# Altium project DAC5682.PrjPcb
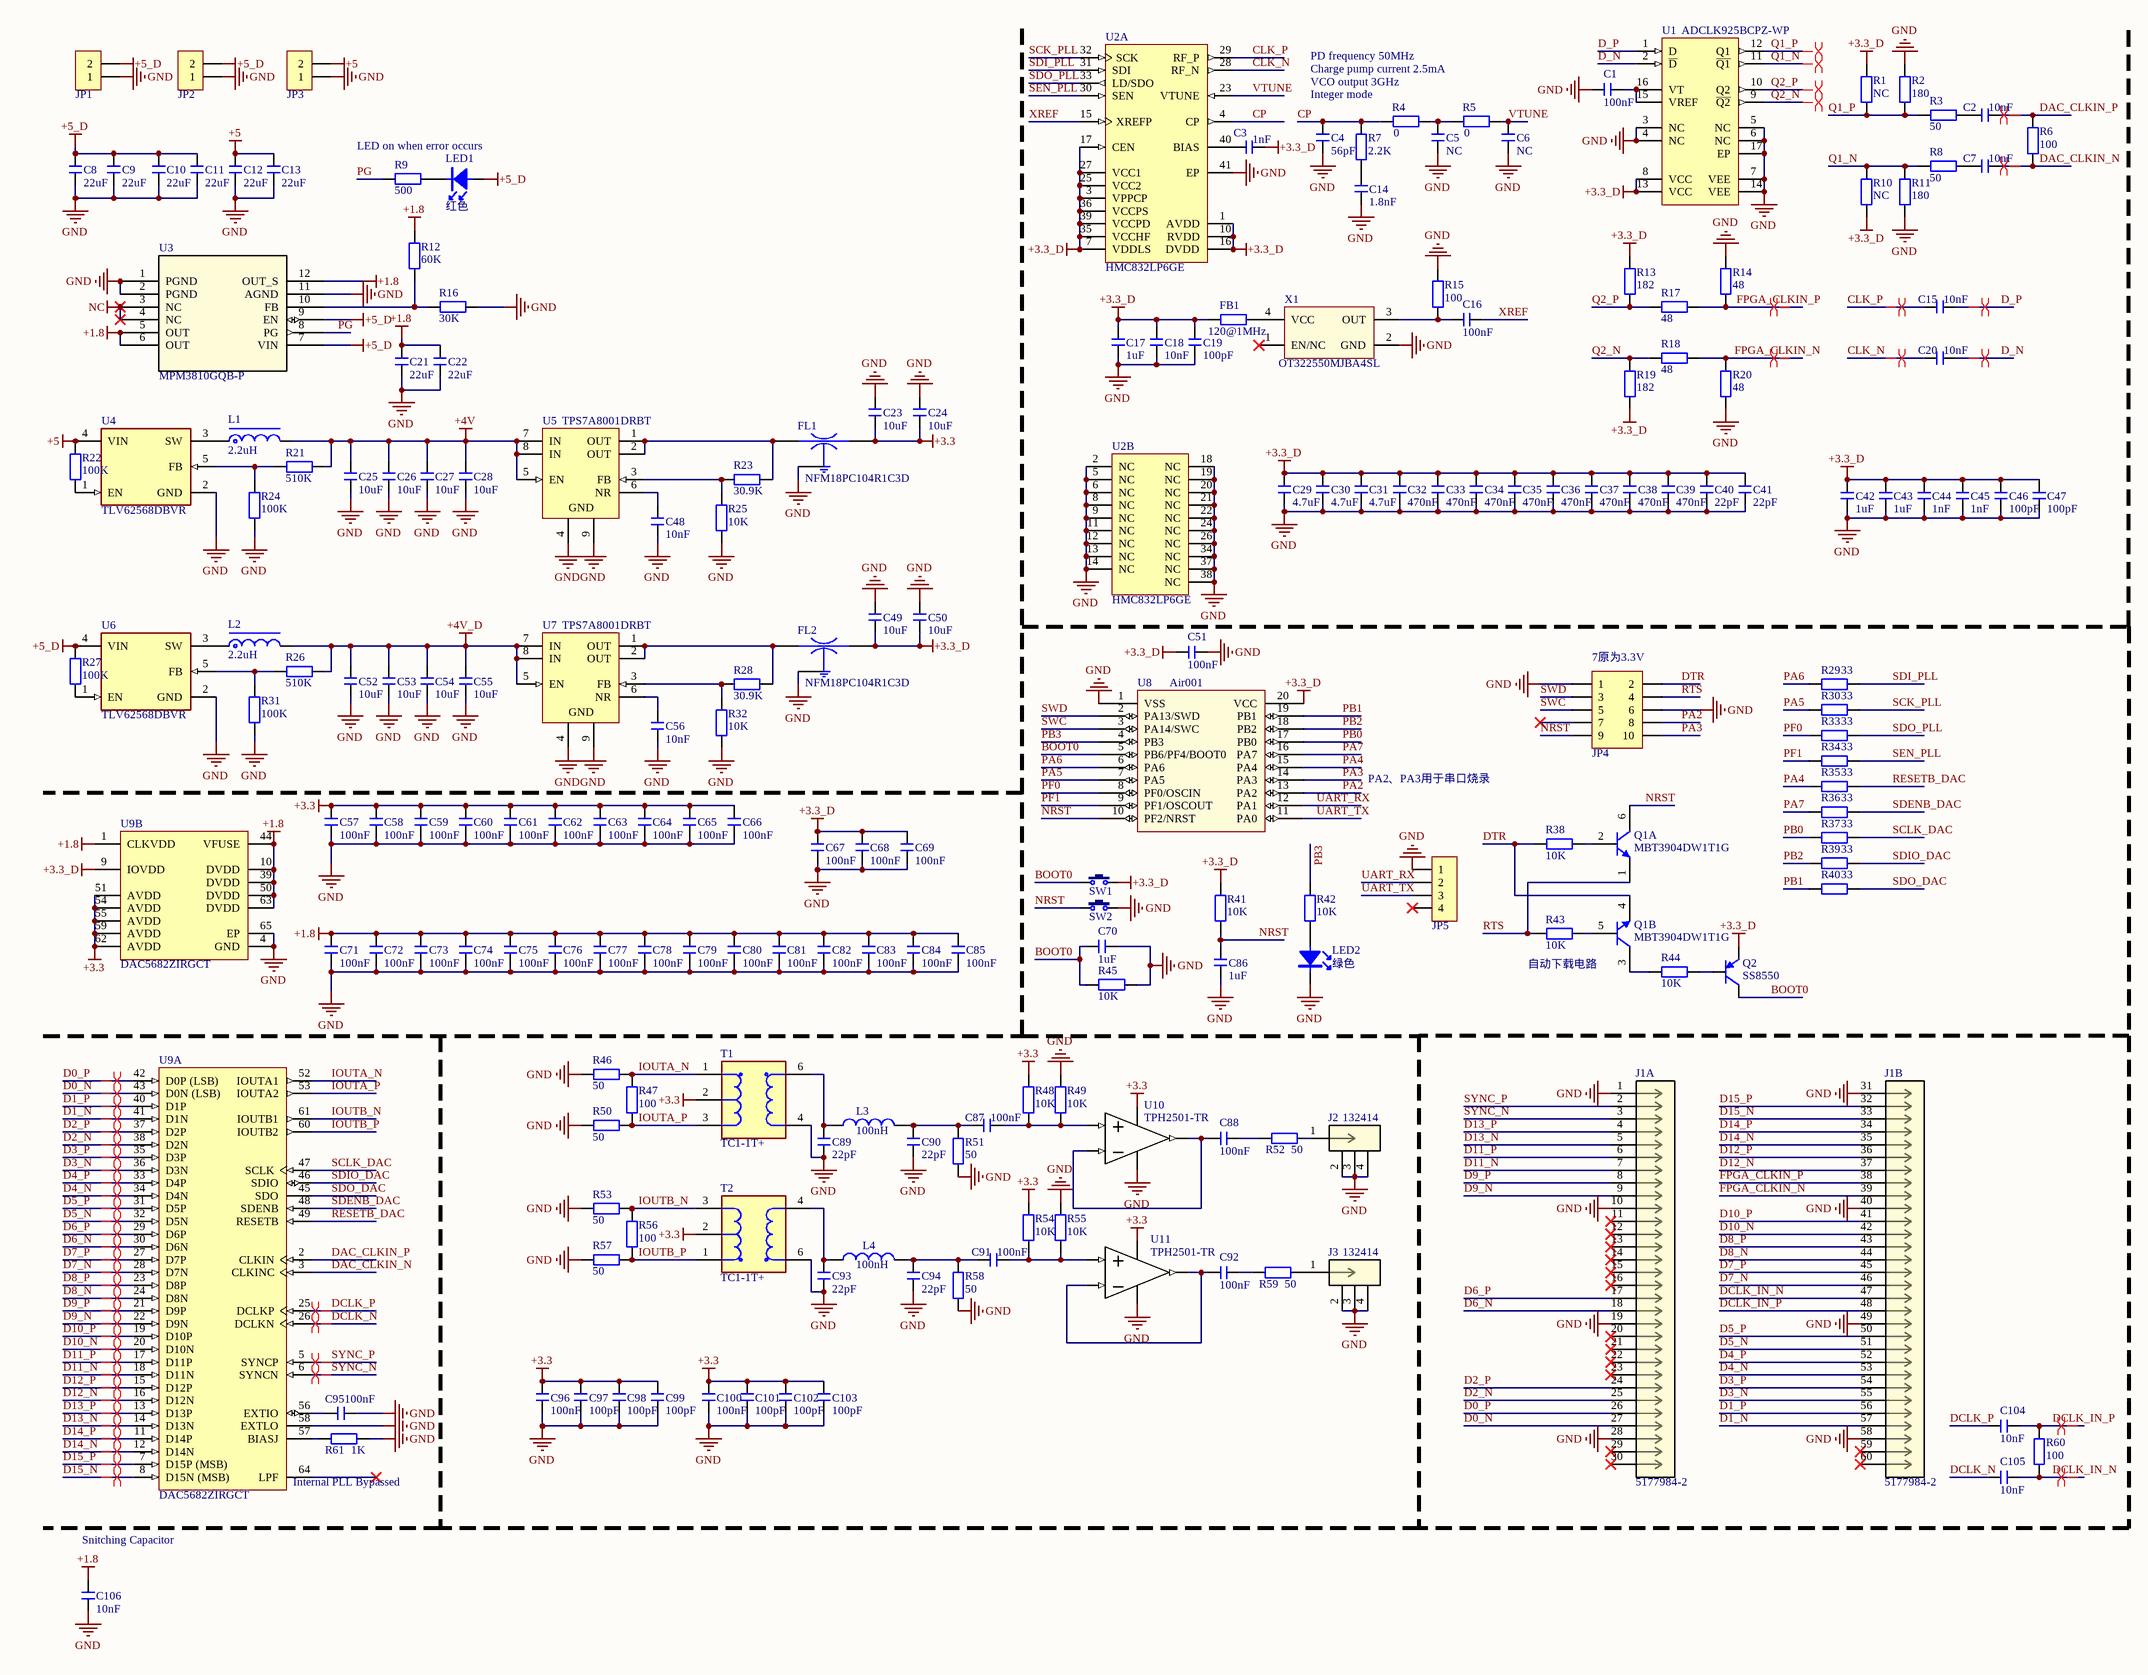
[diagram p0: DAC5682.SchDoc]
1 sheet, 202 parts. Net scope: global (net labels, ports and power ports of the same name join across sheets).
Board file: DAC5682.PcbDoc

## Sheet DAC5682.SchDoc
size A2; SheetNumber: 1; SheetTotal: 1

### Parts
C1  100nF  [C 0402_L]
C2  10nF  [C 0402_L]
C3  1nF  [C 0402_L]
C4  56pF  [C 0402_L]
C5  NC  [C 0402_L]
C6  NC  [C 0402_L]
C7  10nF  [C 0402_L]
C8  22uF  [C 1206_L]
C9  22uF  [C 1206_L]
C10  22uF  [C 1206_L]
C11  22uF  [C 1206_L]
C12  22uF  [C 1206_L]
C13  22uF  [C 1206_L]
C14  1.8nF  [C 0402_L]
C15  10nF  [C 0402_L]
C16  100nF  [C 0402_L]
C17  1uF  [C 0402_L]
C18  10nF  [C 0402_L]
C19  100pF  [C 0402_L]
C20  10nF  [C 0402_L]
C21  22uF  [C 1206_L]
C22  22uF  [C 1206_L]
C23  10uF  [C 0805_L]
C24  10uF  [C 0805_L]
C25  10uF  [C 0805_L]
C26  10uF  [C 0805_L]
C27  10uF  [C 0805_L]
C28  10uF  [C 0805_L]
C29  4.7uF  [C 0603_L]
C30  4.7uF  [C 0603_L]
C31  4.7uF  [C 0603_L]
C32  470nF  [C 0402_L]
C33  470nF  [C 0402_L]
C34  470nF  [C 0402_L]
C35  470nF  [C 0402_L]
C36  470nF  [C 0402_L]
C37  470nF  [C 0402_L]
C38  470nF  [C 0402_L]
C39  470nF  [C 0402_L]
C40  22pF  [C 0402_L]
C41  22pF  [C 0402_L]
C42  1uF  [C 0603_L]
C43  1uF  [C 0603_L]
C44  1nF  [C 0402_L]
C45  1nF  [C 0402_L]
C46  100pF  [C 0402_L]
C47  100pF  [C 0402_L]
C48  10nF  [C 0402_L]
C49  10uF  [C 0805_L]
C50  10uF  [C 0805_L]
C51  100nF  [C 0402_L]
C52  10uF  [C 0805_L]
C53  10uF  [C 0805_L]
C54  10uF  [C 0805_L]
C55  10uF  [C 0805_L]
C56  10nF  [C 0402_L]
C57  100nF  [C 0402_L]
C58  100nF  [C 0402_L]
C59  100nF  [C 0402_L]
C60  100nF  [C 0402_L]
C61  100nF  [C 0402_L]
C62  100nF  [C 0402_L]
C63  100nF  [C 0402_L]
C64  100nF  [C 0402_L]
C65  100nF  [C 0402_L]
C66  100nF  [C 0402_L]
C67  100nF  [C 0402_L]
C68  100nF  [C 0402_L]
C69  100nF  [C 0402_L]
C70  1uF  [C 0402_L]
C71  100nF  [C 0402_L]
C72  100nF  [C 0402_L]
C73  100nF  [C 0402_L]
C74  100nF  [C 0402_L]
C75  100nF  [C 0402_L]
C76  100nF  [C 0402_L]
C77  100nF  [C 0402_L]
C78  100nF  [C 0402_L]
C79  100nF  [C 0402_L]
C80  100nF  [C 0402_L]
C81  100nF  [C 0402_L]
C82  100nF  [C 0402_L]
C83  100nF  [C 0402_L]
C84  100nF  [C 0402_L]
C85  100nF  [C 0402_L]
C86  1uF  [C 0402_L]
C87  100nF  [C 0402_L]
C88  100nF  [C 0402_L]
C89  22pF  [C 0402_L]
C90  22pF  [C 0402_L]
C91  100nF  [C 0402_L]
C92  100nF  [C 0402_L]
C93  22pF  [C 0402_L]
C94  22pF  [C 0402_L]
C95  100nF  [C 0402_L]
C96  100nF  [C 0402_L]
C97  100pF  [C 0402_L]
C98  100pF  [C 0402_L]
C99  100pF  [C 0402_L]
C100  100nF  [C 0402_L]
C101  100pF  [C 0402_L]
C102  100pF  [C 0402_L]
C103  100pF  [C 0402_L]
C104  10nF  [C 0402_L]
C105  10nF  [C 0402_L]
C106  10nF  [C 0402_L]
FB1  120@1MHz  [R 0603_L]
FL1  NFM18PC104R1C3D  [FIL_NFM18PC104R1C3D]
FL2  NFM18PC104R1C3D  [FIL_NFM18PC104R1C3D]
J1  5177984-2  [CONN_5177984-2_TYC]  (parts A,B of 2)
J2  132414  [CONN_132414_AMP]
J3  132414  [CONN_132414_AMP]
JP1  HDR-1X2  [KF2510-LI-2P]  (value not drawn)
JP2  HDR-1X2  [KF2510-LI-2P]  (value not drawn)
JP3  HDR-1X2  [KF2510-LI-2P]  (value not drawn)
JP4  Header 5X2  [HDR2.54-M-LS-2x5P]  (value not drawn)
JP5  HDR-1X4  [XH2.54-WS-4P]  (value not drawn)
L1  2.2uH  [L-SMD-0630]
L2  2.2uH  [L-SMD-0630]
L3  100nH  [L 0603]
L4  100nH  [L 0603]
LED1  红色  [LED 0603R]
LED2  绿色  [LED 0603G]
Q1  MBT3904DW1T1G  [ONSC-SOT-363-6-419B-02_W_V]  (parts A,B of 2)
Q2  SS8550  [SOT23-3L]
R1  NC  [R 0402_L]
R2  180  [R 0402_L]
R3  50  [R 0402_L]
R4  0  [R 0402_L]
R5  0  [R 0402_L]
R6  100  [R 0402_L]
R7  2.2K  [R 0402_L]
R8  50  [R 0402_L]
R9  500  [R 0402_L]
R10  NC  [R 0402_L]
R11  180  [R 0402_L]
R12  60K  [R 0402_L]
R13  182  [R 0402_L]
R14  48  [R 0402_L]
R15  100  [R 0402_L]
R16  30K  [R 0402_L]
R17  48  [R 0402_L]
R18  48  [R 0402_L]
R19  182  [R 0402_L]
R20  48  [R 0402_L]
R21  510K  [R 0402_L]
R22  100K  [R 0402_L]
R23  30.9K  [R 0402_L]
R24  100K  [R 0402_L]
R25  10K  [R 0402_L]
R26  510K  [R 0402_L]
R27  100K  [R 0402_L]
R28  30.9K  [R 0402_L]
R29  33  [R 0402_L]
R30  33  [R 0402_L]
R31  100K  [R 0402_L]
R32  10K  [R 0402_L]
R33  33  [R 0402_L]
R34  33  [R 0402_L]
R35  33  [R 0402_L]
R36  33  [R 0402_L]
R37  33  [R 0402_L]
R38  10K  [R 0402_L]
R39  33  [R 0402_L]
R40  33  [R 0402_L]
R41  10K  [R 0402_L]
R42  10K  [R 0402_L]
R43  10K  [R 0402_L]
R44  10K  [R 0402_L]
R45  10K  [R 0402_L]
R46  50  [R 0402_L]
R47  100  [R 0402_L]
R48  10K  [R 0402_L]
R49  10K  [R 0402_L]
R50  50  [R 0402_L]
R51  50  [R 0402_L]
R52  50  [R 0402_L]
R53  50  [R 0402_L]
R54  10K  [R 0402_L]
R55  10K  [R 0402_L]
R56  100  [R 0402_L]
R57  50  [R 0402_L]
R58  50  [R 0402_L]
R59  50  [R 0402_L]
R60  100  [R 0402_L]
R61  1K  [R 0402_L]
SW1  3x6x5  [TSW SMD-3*6*2.5]  (value not drawn)
SW2  3x6x5  [TSW SMD-3*6*2.5]  (value not drawn)
T1  TC1-1T+  [FP-TC1-1-13M+-MFG]
T2  TC1-1T+  [FP-TC1-1-13M+-MFG]
U1  ADCLK925BCPZ-WP  [ADI-CP-16-3_L]
U2  HMC832LP6GE  [ADI-LP6G-40_L]  (parts A,B of 2)
U3  MPM3810GQB-P  [QFN2p5x3p0x0p9_MNP]
U4  TLV62568DBVR  [FP-DBV0005A-MFG]
U5  TPS7A8001DRBT  [DRB0008A_V]
U6  TLV62568DBVR  [FP-DBV0005A-MFG]
U7  TPS7A8001DRBT  [DRB0008A_V]
U8  Air001  [TSSOP20_L]
U9  DAC5682ZIRGCT  [TI-RGC64-7400X7400TP_V]  (parts A,B of 2)
U10  TPH2501-TR  [SOT23-5]
U11  TPH2501-TR  [SOT23-5]
X1  OT322550MJBA4SL  [OSC 3225-4P]

### Nets
+1.8: C21.2 C22.2 C71.2 C72.2 C73.2 C74.2 C75.2 C76.2 C77.2 C78.2 C79.2 C80.2 C81.2 C82.2 C83.2 C84.2 C85.2 C106.2 R12.2 U3.5(OUT) U3.6(OUT) U3.12(OUT_S) U9.1(CLKVDD) U9.10(DVDD) U9.39(DVDD) U9.44(VFUSE) U9.50(DVDD) U9.63(DVDD)
+3.3: C23.1 C24.1 C57.2 C58.2 C59.2 C60.2 C61.2 C62.2 C63.2 C64.2 C65.2 C66.2 C96.2 C97.2 C98.2 C99.2 C100.2 C101.2 C102.2 C103.2 FL1.3(OUT) R48.2 R54.2 T1.2(SECONDARY) T2.2(SECONDARY) U9.51(AVDD) U9.54(AVDD) U9.55(AVDD) U9.59(AVDD) U9.62(AVDD) U10.5(+Vs) U11.5(+Vs)
+3.3_D: C3.1 C17.2 C18.2 C19.2 C29.2 C30.2 C31.2 C32.2 C33.2 C34.2 C35.2 C36.2 C37.2 C38.2 C39.2 C40.2 C41.2 C42.2 C43.2 C44.2 C45.2 C46.2 C47.2 C49.1 C50.1 C51.1 C67.2 C68.2 C69.2 FB1.1 FL2.3(OUT) Q2.2(E) R1.2 R10.1 R13.2 R19.1 R41.1 SW1.2 U1.8(VCC) U1.13(VCC) U2.1(AVDD) U2.3(VPPCP) U2.7(VDDLS) U2.10(RVDD) U2.16(DVDD) U2.17(CEN) U2.25(VCC2) U2.27(VCC1) U2.35(VCCHF) U2.36(VCCPS) U2.39(VCCPD) U8.20(VCC) U9.9(IOVDD)
+4V: C25.2 C26.2 C27.2 C28.2 L1.2 R21.1 U5.5(EN) U5.7(IN) U5.8(IN)
+4V_D: C52.2 C53.2 C54.2 C55.2 L2.2 R26.1 U7.5(EN) U7.7(IN) U7.8(IN)
+5: C12.2 C13.2 JP3.2 R22.1 U4.4(VIN)
+5_D: C8.2 C9.2 C10.2 C11.2 JP1.2 JP2.2 LED1.1(A) R27.1 U3.7(VIN) U3.9(EN) U6.4(VIN)
GND: C1.2 C4.1 C5.1 C6.1 C8.1 C9.1 C10.1 C11.1 C12.1 C13.1 C14.1 C17.1 C18.1 C19.1 C21.1 C22.1 C23.2 C24.2 C25.1 C26.1 C27.1 C28.1 C29.1 C30.1 C31.1 C32.1 C33.1 C34.1 C35.1 C36.1 C37.1 C38.1 C39.1 C40.1 C41.1 C42.1 C43.1 C44.1 C45.1 C46.1 C47.1 C48.2 C49.2 C50.2 C51.2 C52.1 C53.1 C54.1 C55.1 C56.2 C57.1 C58.1 C59.1 C60.1 C61.1 C62.1 C63.1 C64.1 C65.1 C66.1 C67.1 C68.1 C69.1 C70.1 C71.1 C72.1 C73.1 C74.1 C75.1 C76.1 C77.1 C78.1 C79.1 C80.1 C81.1 C82.1 C83.1 C84.1 C85.1 C86.2 C89.2 C90.2 C93.2 C94.2 C95.2 C96.1 C97.1 C98.1 C99.1 C100.1 C101.1 C102.1 C103.1 C106.1 FL1.2(GND) FL2.2(GND) J1.1 J1.10 J1.19 J1.28 J1.31 J1.40 J1.49 J1.58 J2.2 J2.3 J2.4 J3.2 J3.3 J3.4 JP1.1 JP2.1 JP3.1 JP4.1 JP4.6 JP5.1 LED2.2(K) R2.2 R11.1 R14.2 R15.2 R16.2 R20.1 R24.2 R25.1 R31.2 R32.1 R45.1 R46.1 R49.2 R50.1 R51.1 R53.1 R55.2 R57.1 R58.1 R61.2 SW2.2 T1.4(PRIMARY) T2.6(PRIMARY_DOT) U1.3(NC) U1.4(NC) U1.5(NC) U1.6(NC) U1.7(VEE) U1.14(VEE) U1.17(EP) U2.2(NC) U2.5(NC) U2.6(NC) U2.8(NC) U2.9(NC) U2.11(NC) U2.12(NC) U2.13(NC) U2.14(NC) U2.18(NC) U2.19(NC) U2.20(NC) U2.21(NC) U2.22(NC) U2.24(NC) U2.26(NC) U2.34(NC) U2.37(NC) U2.38(NC) U2.41(EP) U3.1(PGND) U3.2(PGND) U3.11(AGND) U4.2(GND) U5.4(GND) U5.9(GND) U6.2(GND) U7.4(GND) U7.9(GND) U8.1(VSS) U9.4(GND) U9.58(EXTLO) U9.65(EP) U10.2(-Vs) U11.2(-Vs) X1.2(GND)
NC: U3.3(NC) U3.4(NC)
BOOT0: C70.2 Q2.3(C) R45.2 SW1.1 U8.5(PB6/PF4/BOOT0)
CLK_N: C20.1 U2.28(RF_N)
CLK_P: C15.1 U2.29(RF_P)
CP: C4.2 R4.2 R7.2 U2.4(CP)
D0_N: J1.27 U9.43(D0N_(LSB))
D0_P: J1.26 U9.42(D0P_(LSB))
D1_N: J1.57 U9.41(D1N)
D1_P: J1.56 U9.40(D1P)
D2_N: J1.25 U9.38(D2N)
D2_P: J1.24 U9.37(D2P)
D3_N: J1.55 U9.36(D3N)
D3_P: J1.54 U9.35(D3P)
D4_N: J1.53 U9.34(D4N)
D4_P: J1.52 U9.33(D4P)
D5_N: J1.51 U9.32(D5N)
D5_P: J1.50 U9.31(D5P)
D6_N: J1.18 U9.30(D6N)
D6_P: J1.17 U9.29(D6P)
D7_N: J1.46 U9.28(D7N)
D7_P: J1.45 U9.27(D7P)
D8_N: J1.44 U9.24(D8N)
D8_P: J1.43 U9.23(D8P)
D9_N: J1.9 U9.22(D9N)
D9_P: J1.8 U9.21(D9P)
D10_N: J1.42 U9.20(D10N)
D10_P: J1.41 U9.19(D10P)
D11_N: J1.7 U9.18(D11N)
D11_P: J1.6 U9.17(D11P)
D12_N: J1.37 U9.16(D12N)
D12_P: J1.36 U9.15(D12P)
D13_N: J1.5 U9.14(D13N)
D13_P: J1.4 U9.13(D13P)
D14_N: J1.35 U9.12(D14N)
D14_P: J1.34 U9.11(D14P)
D15_N: J1.33 U9.8(D15N_(MSB))
D15_P: J1.32 U9.7(D15P_(MSB))
D_N: C20.2 U1.2(~{D})
D_P: C15.2 U1.1(D)
DAC_CLKIN_N: C7.2 R6.1 U9.3(CLKINC)
DAC_CLKIN_P: C2.2 R6.2 U9.2(CLKIN)
DCLK_IN_N: C105.2 J1.47 R60.1
DCLK_IN_P: C104.2 J1.48 R60.2
DCLK_N: C105.1 U9.26(DCLKN)
DCLK_P: C104.1 U9.25(DCLKP)
DTR: JP4.2 Q1.4(E) R38.1
FPGA_CLKIN_N: J1.39 R18.2 R20.2
FPGA_CLKIN_P: J1.38 R14.1 R17.2
IOUTA_N: R46.2 R47.2 T1.1(SECONDARY_DOT) U9.52(IOUTA1)
IOUTA_P: R47.1 R50.2 T1.3(SECONDARY_MID) U9.53(IOUTA2)
IOUTB_N: R53.2 R56.2 T2.3(SECONDARY_MID) U9.61(IOUTB1)
IOUTB_P: R56.1 R57.2 T2.1(SECONDARY_DOT) U9.60(IOUTB2)
NRST: C86.1 JP4.9 Q1.6(C) R41.2 SW2.1 U8.10(PF2/NRST)
PA2: JP4.8 U8.13(PA2)
PA3: JP4.10 U8.14(PA3)
PA4: R35.1 U8.15(PA4)
PA5: R30.1 U8.7(PA5)
PA6: R29.1 U8.6(PA6)
PA7: R36.1 U8.16(PA7)
PB0: R37.1 U8.17(PB0)
PB1: R40.1 U8.19(PB1)
PB2: R39.1 U8.18(PB2)
PB3: R42.1 U8.4(PB3)
PF0: R33.1 U8.8(PF0/OSCIN)
PF1: R34.1 U8.9(PF1/OSCOUT)
PG: R9.1 U3.8(PG)
Q1_N: R8.1 R10.2 R11.2 U1.11(~{Q1})
Q1_P: R1.1 R2.1 R3.1 U1.12(Q1)
Q2_N: R18.1 R19.2 U1.9(~{Q2})
Q2_P: R13.1 R17.1 U1.10(Q2)
RESETB_DAC: R35.2 U9.49(RESETB)
RTS: JP4.4 Q1.1(E) R43.1
SCK_PLL: R30.2 U2.32(SCK)
SCLK_DAC: R37.2 U9.47(SCLK)
SDENB_DAC: R36.2 U9.48(SDENB)
SDI_PLL: R29.2 U2.31(SDI)
SDIO_DAC: R39.2 U9.46(SDIO)
SDO_DAC: R40.2 U9.45(SDO)
SDO_PLL: R33.2 U2.33(LD/SDO)
SEN_PLL: R34.2 U2.30(SEN)
SWC: JP4.5 U8.3(PA14/SWC)
SWD: JP4.3 U8.2(PA13/SWD)
SYNC_N: J1.3 U9.6(SYNCN)
SYNC_P: J1.2 U9.5(SYNCP)
UART_RX: JP5.2 U8.12(PA1)
UART_TX: JP5.3 U8.11(PA0)
VTUNE: C6.2 R5.1 U2.23(VTUNE)
XREF: C16.1 U2.15(XREFP)
NetC1_1: C1.1 U1.15(VREF) U1.16(VT)
NetC2_1: C2.1 R3.2
NetC3_2: C3.2 U2.40(BIAS)
NetC5_2: C5.2 R4.1 R5.2
NetC7_1: C7.1 R8.2
NetC14_2: C14.2 R7.1
NetC16_2: C16.2 R15.1 X1.3(OUT)
NetC48_1: C48.1 U5.6(NR)
NetC56_1: C56.1 U7.6(NR)
NetC87_1: C87.1 R48.1 R49.1 U10.3(+In)
NetC87_2: C87.2 C90.1 L3.2 R51.2
NetC88_1: C88.1 R52.2
NetC88_2: C88.2 U10.1(OUT) U10.4(-In)
NetC89_1: C89.1 L3.1 T1.6(PRIMARY_DOT)
NetC91_1: C91.1 R54.1 R55.1 U11.3(+In)
NetC91_2: C91.2 C94.1 L4.2 R58.2
NetC92_1: C92.1 R59.2
NetC92_2: C92.2 U11.1(OUT) U11.4(-In)
NetC93_1: C93.1 L4.1 T2.4(PRIMARY)
NetC95_1: C95.1 U9.56(EXTIO)
NetFB1_2: FB1.2 X1.4(VCC)
NetFL1_1: FL1.1(IN) R23.2 U5.1(OUT) U5.2(OUT)
NetFL2_1: FL2.1(IN) R28.2 U7.1(OUT) U7.2(OUT)
NetJ2_1: J2.1 R52.1
NetJ3_1: J3.1 R59.1
NetL1_1: L1.1 U4.3(SW)
NetL2_1: L2.1 U6.3(SW)
NetLED1_2: LED1.2(K) R9.2
NetLED2_1: LED2.1(A) R42.2
NetQ1_2: Q1.2(B) R38.2
NetQ1_3: Q1.3(C) R44.1
NetQ1_5: Q1.5(B) R43.2
NetQ2_1: Q2.1(B) R44.2
NetR12_1: R12.1 R16.1 U3.10(FB)
NetR21_2: R21.2 R24.1 U4.5(FB)
NetR22_2: R22.2 U4.1(EN)
NetR23_1: R23.1 R25.2 U5.3(FB)
NetR26_2: R26.2 R31.1 U6.5(FB)
NetR27_2: R27.2 U6.1(EN)
NetR28_1: R28.1 R32.2 U7.3(FB)
NetR61_1: R61.1 U9.57(BIASJ)

Not connected (* = marked no-connect by the designer): J1 11* 12* 13* 14* 15* 16* 20* 21* 22* 23* 29* 30* 59* 60*; JP4 7*; JP5 4*; U9 64(LPF)*; X1 1(EN/NC)*

### Layout directives
differential pair: CLK_N, CLK_P, D0_N, D0_P, D1_N, D1_P, D2_N, D2_P, D3_N, D3_P, D4_N, D4_P, D5_N, D5_P, D6_N, D6_P, D7_N, D7_P, D8_N, D8_P, D9_N, D9_P, D10_N, D10_P, D11_N, D11_P, D12_N, D12_P, D13_N, D13_P, D14_N, D14_P, D15_N, D15_P, D_N, D_P, DAC_CLKIN_N, DAC_CLKIN_P, DCLK_IN_N, DCLK_IN_P, DCLK_N, DCLK_P, FPGA_CLKIN_N, FPGA_CLKIN_P, Q1_N, Q1_P, Q2_N, Q2_P, SYNC_N, SYNC_P

### Notes on the sheet
- PD frequency 50MHz
- Charge pump current 2.5mA
- VCO output 3GHz
- Integer mode
- LED on when error occurs
- (near JP4) 7原为3.3V
- PA2、PA3用于串口烧录
- (near R43) 自动下载电路
- (near U9) Internal PLL Bypassed
- Snitching Capacitor

### Library data of the parts
C1-C106 = C: 贴片电容; 淘宝ID: 小糖豆的小窝窝; BOM名称: 贴片电容; 下单链接: https://item.taobao.com/item.htm?ft=t&id=613637044352
FB1 R1-R61 = R: 贴片电阻; 淘宝ID: 小糖豆的小窝窝; BOM名称: 贴片电阻; 下单链接: https://item.taobao.com/item.htm?ft=t&id=613637044352
FL1 FL2 = NFM18PC104R1C3D: SMD Capacitor with Capacitance: 0.10uF Tol. 20%. Rated Voltage: 16Vdc; MF: Murata; Digi-Key_Part_Number: 490-6969-1-ND; SnapEDA_Link: https://www.snapeda.com/parts/NFM18PC104R1C3D/Murata/view-part/4375738/?ref=snap; Package: NONSTANDARD; MP: NFM18PC104R1C3D; Digi-Key_Purchase_URL: https://www.digikey.com/product-detail/en/murata-electronics/NFM18PC104R1C3D/490-6969-1-ND/3846166?utm_source=snapeda&utm_medium=aggregator&utm_campaign=symbol; Value: *
J1 = 5177984-2: No Description Available; Mfr_Name: TE Connectivity; Copyright: Copyright (C) 2022 Ultra Librarian. All rights reserved.; Manufacturer_Part_Number: 5177984-2; RefDes: RefDes; Type: DEV
J2 J3 = 132414: No Description Available; Mfr_Name: Amphenol ICC; Copyright: Copyright (C) 2022 Ultra Librarian. All rights reserved.; Manufacturer_Part_Number: 132414; RefDes: RefDes; Type: DEV
JP1-JP3 = Header 2: 2P接插件; 淘宝ID: 小糖豆的小窝窝; BOM名称: 2P接插件; 下单链接: https://item.taobao.com/item.htm?ft=t&id=613637044352
JP4 = Header 5X2: 5*2P接插件; 淘宝ID: 小糖豆的小窝窝; BOM名称: 5*2P接插件; 下单链接: https://item.taobao.com/item.htm?ft=t&id=613637044352
JP5 = Header 4: 4P接插件; 淘宝ID: 小糖豆的小窝窝; BOM名称: 4P接插件; 下单链接: https://item.taobao.com/item.htm?ft=t&id=613637044352
L1 L2 = L-CDRH: 功率屏蔽电感; 淘宝ID: 小糖豆的小窝窝; BOM名称: 功率屏蔽电感; 下单链接: https://item.taobao.com/item.htm?ft=t&id=613637044352
L3 L4 = L: 小功率贴片电感; BOM名称: 小功率贴片电感; 下单链接: https://item.taobao.com/item.htm?ft=t&id=613637044352
LED1 LED2 = LED-SMD: 贴片LED; 淘宝ID: 小糖豆的小窝窝; BOM名称: 贴片LED; 下单链接: https://item.taobao.com/item.htm?ft=t&id=613637044352
Q1 = CMP-1048-00877-1: Dual General Purpose Transistors, 6-Pin SOT-363, Pb-Free, Tape and Reel; Manufacturer: On Semiconductor; Polarity: Dual NPN; fT Min (MHz): 300; IC Continuous (A): 0.2; DatasheetVersion: Rev. 9; ComponentLink2Description: Datasheet; Mounting Technology: Surface Mount; PackageReference: SOT-363-6-419B-02_W; RoHS: TRUE; ComponentLink1Description: Manufacturer URL; ComponentLink2URL: http://www.onsemi.com/pub_link/Collateral/MBT3904DW1T1-D.PDF; PackageVersion: Rev. W, 01/2006; Packing: Tape and Reel; PartNumber: MBT3904DW1T1G; ComponentLink1URL: http://www.onsemi.com/; ComponentLink3URL: http://www.onsemi.com/pub_link/Collateral/NTJD4001N-D.PDF; ComponentLink3Description: Package Specification; PackageDescription: 6-Pin Small Outline Transistor, Body 2 x 1.25 mm, Pitch 0.65 mm
Q2 = 8550-SMD: 高频放大-PNP型; 淘宝ID: 小糖豆的小窝窝; BOM名称: 高频放大-PNP型; 下单链接: https://item.taobao.com/item.htm?ft=t&id=613637044352
SW1 SW2 = TSW 3x6: 3x6轻触开关; 淘宝ID: 小糖豆的小窝窝; BOM名称: 3x6轻触开关; 下单链接: https://item.taobao.com/item.htm?ft=t&id=613637044352
T1 T2 = CMP-00025-00004-7: RF Transformer 1: 1 5 Terminal SMD; RoHS Compliant: No
U1 = CMP-0288-00091-1: Ultrafast SiGe ECL Clock/Data Buffers, CP-16-3, Pb-Free, 50 Tray; Output Logic: ECL; LVPECL; PECL; On-Chip VCO or DCO: No; Product Description: Clock Buffer; Outputs: 2; Inputs: 1; Max f-out (MHz): 6000; +Supply Voltage (V): 3.3; ComponentLink1Description: Manufacturer URL; PackageDescription: 16-Lead Lead Frame Chip Scale Package [LFCSP_VQ]; ComponentLink3URL: http://www.analog.com/static/imported-files/packages/PKG_PDF/LFCSP(CP)/CP_16_3.pdf; PackageVersion: Jan-2005; PackageReference: CP-16-3; ComponentLink1URL: www.analog.com; DatasheetVersion: Rev. 0; ComponentLink2Description: Datasheet; Code_JEDEC: MO-220-VEED-2; ComponentLink3Description: Package Specification; ComponentLink2URL: http://www.analog.com/static/imported-files/data_sheets/ADCLK905_907_925.pdf
U2 = CMP-0287-00184-1: Fractional-N PLL with Integrated VCO 25 MHz to 3000 MHz, 3.1 to 3.5 V, -40 to 85 degC, 40-Pin QFN (LP6G), RoHS, Tape and Reel; DVDD Max: 3.1 V; Resolution Typ: 3 Hz; DVDD Min: 3.5 V; ComponentLink1URL: http://www.analog.com/en/index.html; RoHS: TRUE; DatasheetVersion: Rev. A; ComponentLink2Description: Datasheet; ComponentLink2URL: http://www.analog.com/media/en/technical-documentation/data-sheets/HMC832.pdf; PackageDescription: 40-Pin Quad Flat No-Lead Package, Body 6 x 6 mm, Pitch 0.5 mm; ComponentLink3Description: Package Specification; ComponentLink3URL: http://www.analog.com/media/en/quality/hmc-qtr/QTR_2014-00368.pdf; Temperature Max: 85 degC; Mounting Technology: Surface Mount; PartNumber: HMC832LP6GE; ComponentLink1Description: Manufacturer URL; Packing: Tape and Reel; Temperature Min: -40 degC
U3 = MPM3810GQB-P: 6V Input, 1.2A Module,Synchronous Step-Down Converter,with Integrated Inductor; Mfr_Name: Monolithic Power Systems; RefDes: RefDes; Type: Type
U4 U6 = CMP-04918-000009-1: IC REG BUCK ADJ 1A SOT23-5; Manufacturer: Texas Instruments; Number Of Outputs: 1; Max Supply Voltage: 5.5V; Nominal Supply Current: 35uA; Standoff Height: 0mm; Max Junction Temp: +125°C; Output Voltage: 0.6-5.5V; Max Duty Cycle: 100%; Output Type: AdjustableProgrammable; Min Supply Voltage: 2.5V; Switching Frequency: 1.5MHz; Height: 1.45mm; Mouser Description: 1-A High Efficiency Synchronous Buck Converter, SMD, 5-pin SOT-23, T/R 3k; Temperature Range High: +125°C; Manufacturer Part Number: TLV62568DBVR; Switching Topology: Buck; ComponentLink2Description: Datasheet; Digikey Description: IC REG BUCK ADJ 1A SOT23-5; Octopart: https://octopart.com/tlv62568dbvr-texas+instruments-76926199; Category: IC; Device Class L1: Integrated Circuits (ICs); RoHS: TRUE; ComponentLink2URL: http://www.ti.com/lit/ds/symlink/tlv62568.pdf; Lead Free: Yes; Package: DBV0005A; Automotive: No; Device Class L2: Power Management ICs; Temperature: -40°C to +125°C; Temperature Range Low: -40°C; Device Class L3: Voltage Regulators - Switching; Output Current: 1A
U5 U7 = CMP-0395-00597-2: Single Output LDO, 1 A, Adjustable 0.8 to 6 V Output, 2.2 to 6.5 V Input, with High-Bandwidth PSRR, 8-pin SON (DRB), -40 to 125 degC, Green (RoHS & no Sb/Br); Manufacturer: Texas Instruments; Vin(Min)(V): 2.2; Iq(Typ)(mA): 0.04; Vout Adj(Max)(V): 6; SubFamily: Single Channel LDO; Accuracy(%): 3; Vin(Max)(V): 6.5; Vdo(Typ)(mV): 170; Vout Adj(Min)(V): 0.8; Iout(Max)(A): 1; PackageReference: DRB0008A; ComponentLink3URL: http://www.ti.com/litv/pdf/mpds118h; Eco-Plan: Green (RoHS & no Sb/Br); ComponentLink2Description: Datasheet; PackageVersion: 4203482-2/K; PackageDescription: 8-Pin Plastic Small Outline, Body 3 x 3 mm, Pitch 0.65 mm; ComponentLink2URL: http://www.ti.com/general/docs/lit/getliterature.tsp?genericPartNumber=TPS7A8001&fileType=pdf; ComponentLink1Description: Manufacturer URL; DatasheetVersion: SBVS135G; ComponentLink1URL: http://www.ti.com/; Mounting Technology: Surface Mount; PartNumber: TPS7A8001DRBT; ComponentLink3Description: Package Specification
U9 = CMP-0004-01427-1: 16-Bit, 1 GSPS 2 x - 4 x Interpolating Dual-Channel DAC, -40 to 85 degC, 64-pin QFN (RGC64), Green (RoHS & no Sb/Br); Manufacturer: Texas Instruments; SFDR(dB): 81; Power Consumption(Typ)(mW): 1310; DAC Channels: 2; SNR(dB): 75; Resolution(Bits): 16; Settling Time(us): 0.0104; Interface: Parallel LVDS; SubFamily: High Speed DAC (>10MSPS); PackageDescription: 64-Pin Plastic Quad Flatpack No-Lead, Body 9 x 9 mm, Pitch 0.5 mm; PartNumber: DAC5682ZIRGCT; ComponentLink3Description: Package Specification; PackageReference: RGC64-7400X7400TP; ComponentLink1Description: Manufacturer URL; PackageVersion: 4204106/F, 11/2011; ComponentLink2URL: http://www.ti.com/general/docs/lit/getliterature.tsp?genericPartNumber=DAC5682Z&fileType=pdf; Eco-Plan: Green (RoHS & no Sb/Br); DatasheetVersion: SLLS853E; ComponentLink2Description: Datasheet; ComponentLink3URL: http://www.ti.com/litv/pdf/mpqf125e; ComponentLink1URL: http://www.ti.com/; Mounting Technology: Surface Mount
X1 = XTAL-ACT-4P: 4脚有源晶振; 淘宝ID: 小糖豆的小窝窝; BOM名称: 4脚有源晶振; 下单链接: https://item.taobao.com/item.htm?ft=t&id=613637044352